# EAGLE design DRV8825_SHIELD (EAGLE 9.6.2)
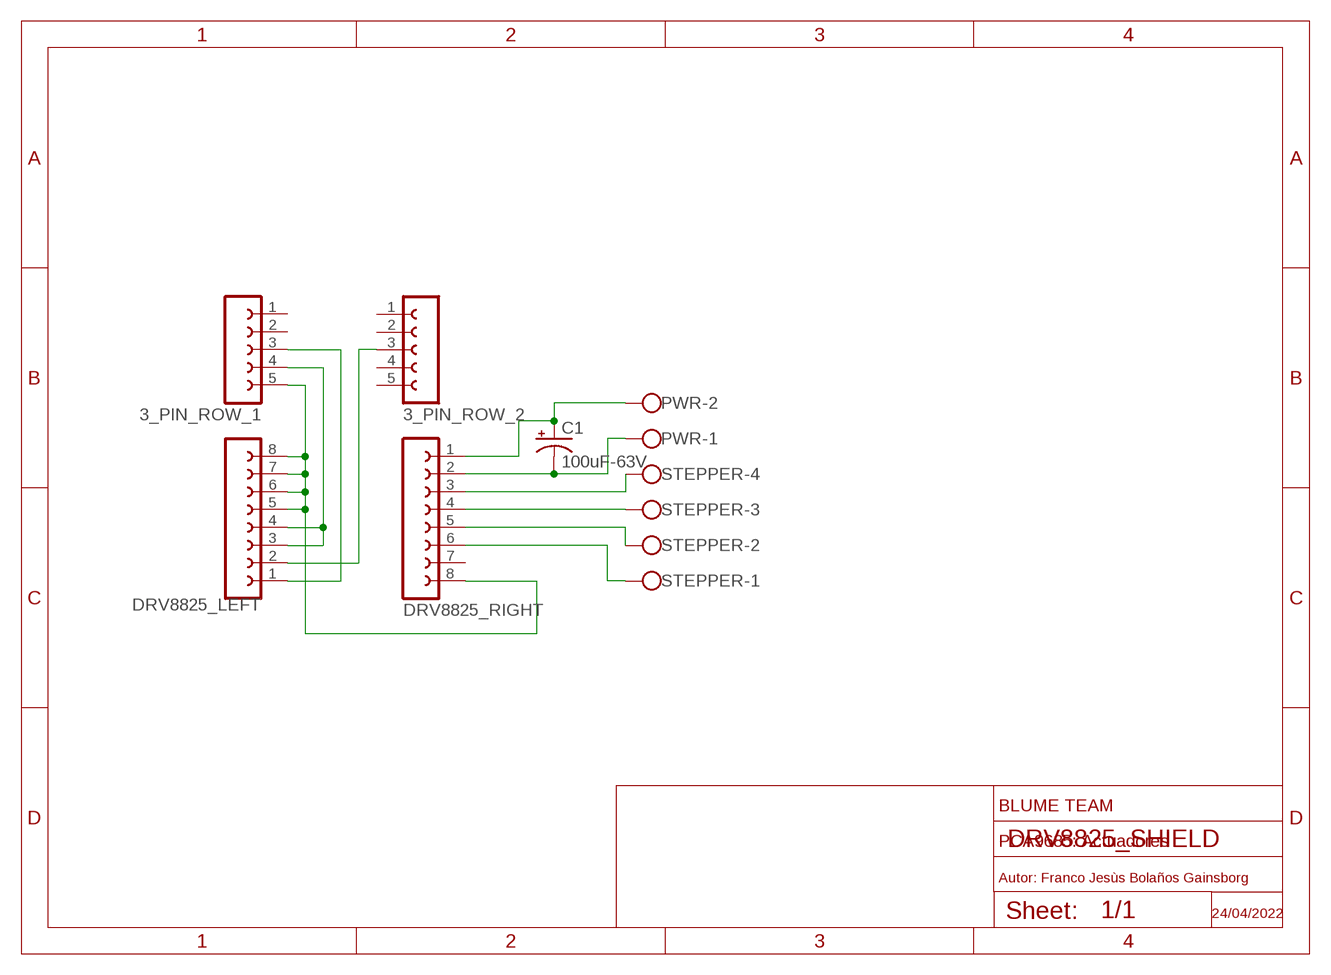
[diagram p0: schematic, sheet 1]

## Parts
3_PIN_ROW_1  FE05-1  [FE05-1]
3_PIN_ROW_2  FE05-1  [FE05-1]
C1  100uF-63V  CPOL-USE5-10.5  [E5-10,5]
DRV8825_LEFT  FE08-1  [FE08]
DRV8825_RIGHT  FE08-1  [FE08]
PWR  W237-102  [W237-102]
STEPPER  W237-4  [W237-4]

## Nets
N$1: DRV8825_RIGHT.3 STEPPER.4
N$2: 3_PIN_ROW_1.5 DRV8825_LEFT.5 DRV8825_LEFT.6 DRV8825_LEFT.7 DRV8825_LEFT.8 DRV8825_RIGHT.8
N$3: 3_PIN_ROW_1.3 DRV8825_LEFT.1
N$4: 3_PIN_ROW_2.3 DRV8825_LEFT.2
N$5: C1.+ DRV8825_RIGHT.1 PWR.2
N$6: C1.- DRV8825_RIGHT.2 PWR.1
N$7: DRV8825_RIGHT.4 STEPPER.3
N$8: 3_PIN_ROW_1.4 DRV8825_LEFT.3 DRV8825_LEFT.4
N$9: DRV8825_RIGHT.5 STEPPER.2
N$10: DRV8825_RIGHT.6 STEPPER.1
Unconnected: 3_PIN_ROW_1.1 3_PIN_ROW_1.2 3_PIN_ROW_2.1 3_PIN_ROW_2.2 3_PIN_ROW_2.4 3_PIN_ROW_2.5 DRV8825_RIGHT.7

## Notes on the sheet
- BLUME TEAM
- PCA9685: Actuadores
- Autor: Franco Jesùs Bolaños Gainsborg
- 24/04/2022

## Library data of the parts
3_PIN_ROW_1 3_PIN_ROW_2 = con-lsta:FE05-1: FEMALE HEADER; OC_FARNELL: unknown; OC_NEWARK: unknown
C1 = rcl:CPOL-US: POLARIZED CAPACITOR, American symbol; SPICEPREFIX: C
DRV8825_LEFT DRV8825_RIGHT = con-lsta:FE08-1: FEMALE HEADER; OC_FARNELL: unknown; OC_NEWARK: unknown
PWR = con-wago-500:W237-102: WAGO SCREW CLAMP; MPN: 237-102; OC_FARNELL: unknown; OC_NEWARK: 70K9898
STEPPER = con-wago-500:W237-4: WAGO SCREW CLAMP; OC_FARNELL: unknown; OC_NEWARK: unknown

## Board
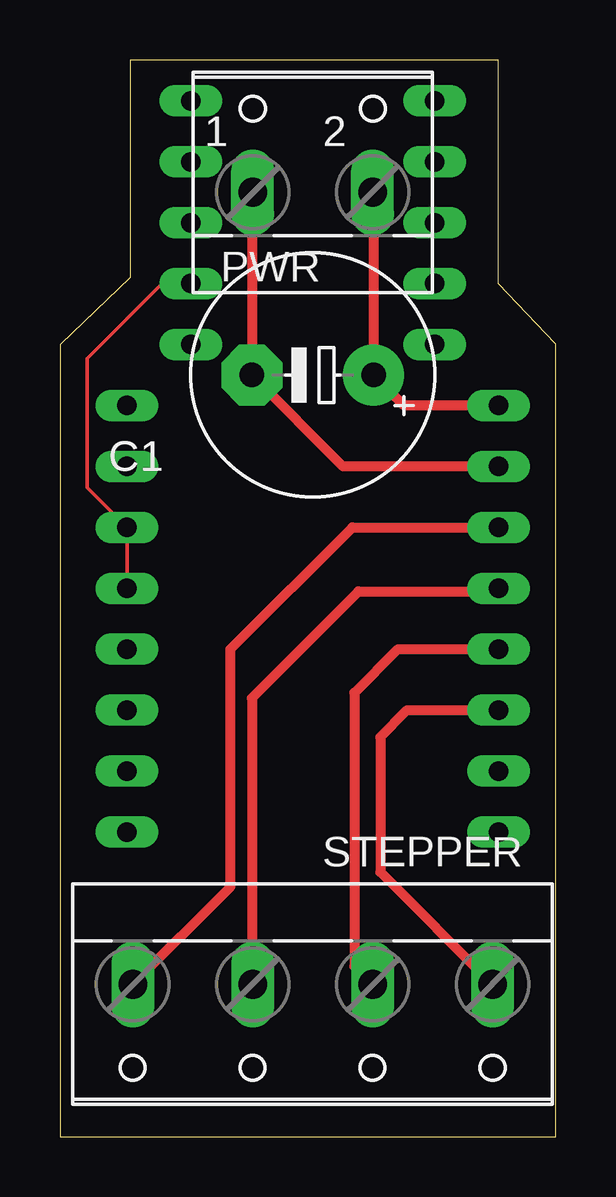
[diagram p1: board, top side]
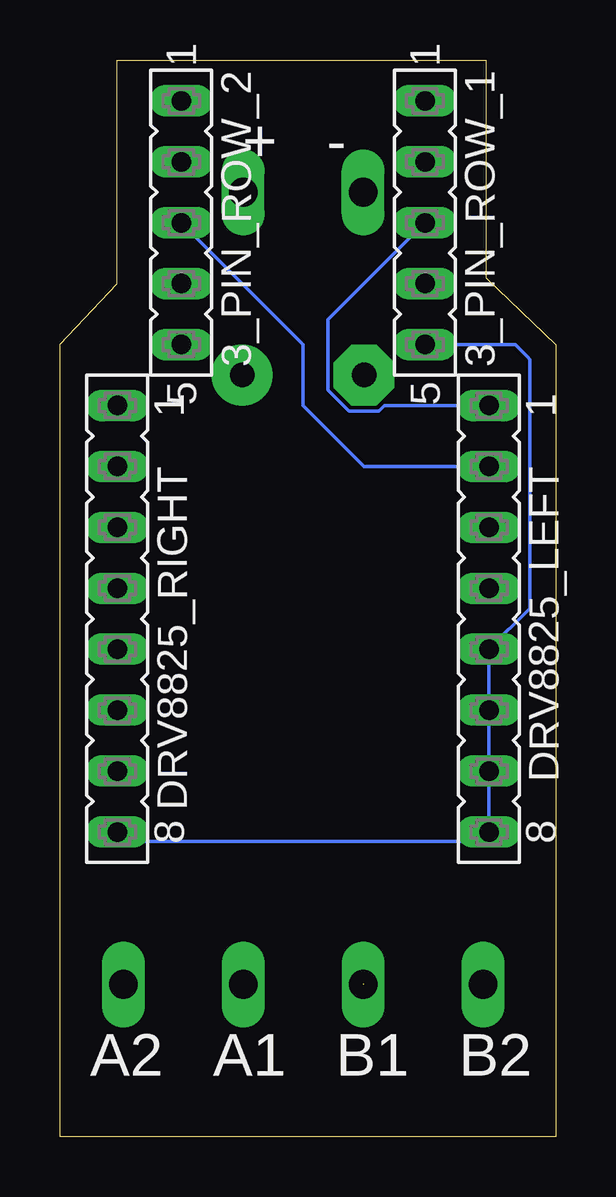
[diagram p2: board, bottom side, seen from below]

Size 20.68 x 44.88 mm. Coordinates in mm from the lower left corner, seen from the top.
Outline: 0,0 20.68,0 20.68,33.04 18.29,35.56 18.29,44.88 2.92,44.88 2.92,35.81 0,33.02 0,0
Copper layers (1*16): Top 0.035mm / dielectric 1.5mm / Bottom 0.035mm
Design rules "default": minimum track width 6mil, minimum drill 0.35mm, track to track 6mil, track to pad 6mil, pad to pad 6mil, via to via 6mil, smd to smd 6mil, copper to edge 40mil, drill to drill 6mil, minimum pad ring 10mil, minimum via ring 8mil, stop-mask expansion 4mil, vias tented up to drill 0mil, thermal gap 10mil

### Footprints (pad centres in the part's own frame; a part is rotated, then mirrored left to right if it is on the bottom)
FE05-1 = drill 0.813 long: 1 -5.08,0; 2 -2.54,0; 3 0,0; 4 2.54,0; 5 5.08,0
E5-10,5 = drill 1.016 pad 2.54: + -2.54,0 | drill 1.016 pad 2.54 octagon: - 2.54,0
FE08 = drill 0.813 long: 1 -8.89,0; 2 -6.35,0; 3 -3.81,0; 4 -1.27,0; 5 1.27,0; 6 3.81,0; 7 6.35,0; 8 8.89,0
W237-102 = drill 1.194 long: 1 -2.5,-1.27; 2 2.5,-1.27
W237-4 = drill 1.194 long: 1 -7.5,-1.27; 2 -2.5,-1.27; 3 2.5,-1.27; 4 7.5,-1.27

### Placement (x,y rotation side)
3_PIN_ROW_1  5.46,38.1 270 bottom
3_PIN_ROW_2  15.62,38.1 270 bottom
C1  10.54,31.75 180 top
DRV8825_LEFT  2.79,21.59 270 bottom
DRV8825_RIGHT  18.29,21.59 270 bottom
PWR  10.54,40.64 0 top
STEPPER  10.54,5.08 180 top

### Tracks (layer width: path | path; a pad name or v marks a point on that pad's centre or on a via)
N$1
  Top 0.406: STEPPER.4 7.11,10.42 7.11,20.32 12.19,25.4 DRV8825_RIGHT.3
N$2
  Bottom 0.152: 4.32,33.02 3_PIN_ROW_1.5 1.69,33.02 1.16,32.5 1.09,32.4 1.09,22.02 DRV8825_LEFT.5 DRV8825_LEFT.6 DRV8825_LEFT.7 DRV8825_LEFT.8 3.17,12.32 17.91,12.32 DRV8825_RIGHT.8
N$3
  Bottom 0.152: 3_PIN_ROW_1.3 9.5,34.06 9.5,31.13 8.62,30.25 7.38,30.25 7.15,30.48 DRV8825_LEFT.1
N$4
  Bottom 0.152: 3_PIN_ROW_2.3 10.54,33.02 10.54,30.48 8,27.94 DRV8825_LEFT.2
N$5
  Top 0.152: PWR.2 13.08,39.33
  Top 0.406: 13.08,39.33 C1.+ 14.35,30.48 DRV8825_RIGHT.1
N$6
  Top 0.152: PWR.1 8,39.33
  Top 0.406: 8,39.33 C1.- 11.81,27.94 DRV8825_RIGHT.2
N$7  (1 unrouted)
  Top 0.152: 18.16,22.73 DRV8825_RIGHT.4
  Top 0.406: 8,6.35 8,18.29 12.45,22.73 18.16,22.73
N$8
  Top 0.152: 3_PIN_ROW_1.4 4.27,35.56 1.14,32.44 1.14,27.05 DRV8825_LEFT.3 DRV8825_LEFT.4
N$9
  Top 0.406: STEPPER.2 12.28,7.11 12.28,18.5 14.1,20.32 DRV8825_RIGHT.5
N$10
  Top 0.406: STEPPER.1 13.36,11.03 13.36,16.66 14.48,17.78 DRV8825_RIGHT.6

### Text on the board
bNames: + - | A2 A1 B1 B2